# EAGLE design motor board (EAGLE 6.5.0)
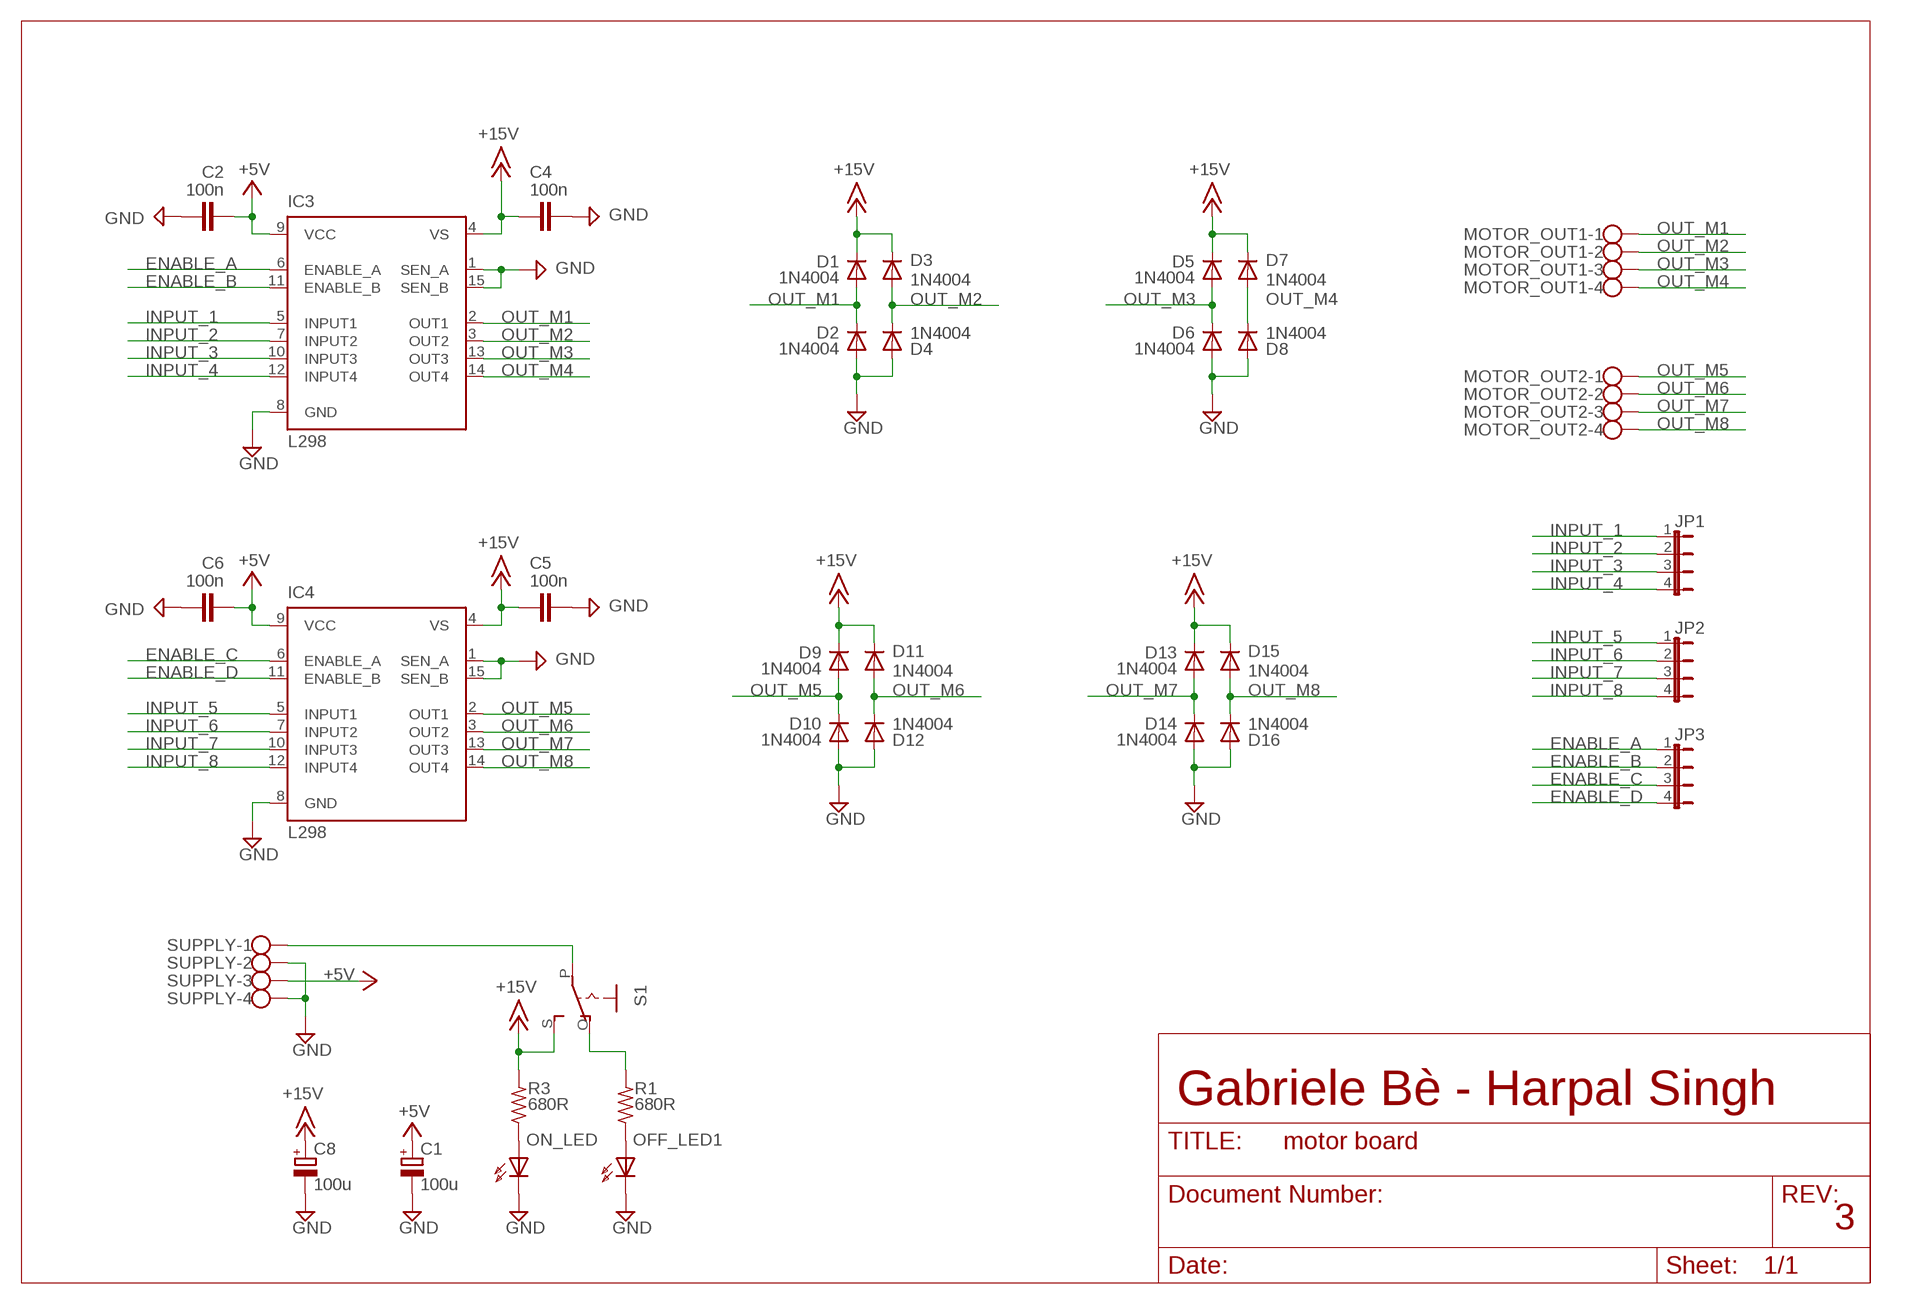
[diagram p0: schematic, sheet 1]

## Parts
C1  100u  CPOL-EUE2.5-7  [E2,5-7]
C2  100n  C-EU050-024X044  [C050-024X044]
C4  100n  C-EU050-024X044  [C050-024X044]
C5  100n  C-EU050-024X044  [C050-024X044]
C6  100n  C-EU050-024X044  [C050-024X044]
C8  100u  CPOL-EUE2.5-7  [E2,5-7]
D1  1N4004  [DO41-10]
D2  1N4004  [DO41-10]
D3  1N4004  [DO41-10]
D4  1N4004  [DO41-10]
D5  1N4004  [DO41-10]
D6  1N4004  [DO41-10]
D7  1N4004  [DO41-10]
D8  1N4004  [DO41-10]
D9  1N4004  [DO41-10]
D10  1N4004  [DO41-10]
D11  1N4004  [DO41-10]
D12  1N4004  [DO41-10]
D13  1N4004  [DO41-10]
D14  1N4004  [DO41-10]
D15  1N4004  [DO41-10]
D16  1N4004  [DO41-10]
IC3  L298  [MULTIWATT-15]
IC4  L298  [MULTIWATT-15]
JP1  JP4E  [JP4]
JP2  JP4E  [JP4]
JP3  JP4E  [JP4]
MOTOR_OUT1  W237-4  [W237-4]
MOTOR_OUT2  W237-4  [W237-4]
OFF_LED1  HLMP6  [HLMP6]
ON_LED  HLMP6  [HLMP6]
R1  680R  R-US_0207/10  [0207/10]
R3  680R  R-US_0207/10  [0207/10]
S1  EG1218S  [EG1218]
SUPPLY  W237-4  [W237-4]

## Nets
+5V: C1.+ C2.2 C6.2 IC3.9(VCC) IC4.9(VCC) SUPPLY.3
+15V: C4.1 C5.1 C8.+ D1.C D3.C D5.C D7.C D9.C D11.C D13.C D15.C IC3.4(VS) IC4.4(VS) R3.2 S1.S
ENABLE_A: IC3.6(ENABLE_A) JP3.1
ENABLE_B: IC3.11(ENABLE_B) JP3.2
ENABLE_C: IC4.6(ENABLE_A) JP3.3
ENABLE_D: IC4.11(ENABLE_B) JP3.4
GND: C1.- C2.1 C4.2 C5.2 C6.1 C8.- D2.A D4.A D6.A D8.A D10.A D12.A D14.A D16.A IC3.1(SEN_A) IC3.8(GND) IC3.15(SEN_B) IC4.1(SEN_A) IC4.8(GND) IC4.15(SEN_B) OFF_LED1.K ON_LED.K SUPPLY.2 SUPPLY.4
INPUT_1: IC3.5(INPUT1) JP1.1
INPUT_2: IC3.7(INPUT2) JP1.2
INPUT_3: IC3.10(INPUT3) JP1.3
INPUT_4: IC3.12(INPUT4) JP1.4
INPUT_5: IC4.5(INPUT1) JP2.1
INPUT_6: IC4.7(INPUT2) JP2.2
INPUT_7: IC4.10(INPUT3) JP2.3
INPUT_8: IC4.12(INPUT4) JP2.4
N$1: OFF_LED1.A R1.1
N$3: ON_LED.A R3.1
N$4: S1.P SUPPLY.1
N$5: R1.2 S1.O
OUT_M1: D1.A D2.C IC3.2(OUT1) MOTOR_OUT1.1
OUT_M2: D3.A D4.C IC3.3(OUT2) MOTOR_OUT1.2
OUT_M3: D5.A D6.C IC3.13(OUT3) MOTOR_OUT1.3
OUT_M4: D7.A D8.C IC3.14(OUT4) MOTOR_OUT1.4
OUT_M5: D9.A D10.C IC4.2(OUT1) MOTOR_OUT2.1
OUT_M6: D11.A D12.C IC4.3(OUT2) MOTOR_OUT2.2
OUT_M7: D13.A D14.C IC4.13(OUT3) MOTOR_OUT2.3
OUT_M8: D15.A D16.C IC4.14(OUT4) MOTOR_OUT2.4

## Notes on the sheet
- Gabriele Bè - Harpal Singh
- 3

## Library data of the parts
C1 C8 = ITIS:CPOL-EU: POLARIZED CAPACITOR, European symbol
C2 C4-C6 = rcl:C-EU: CAPACITOR, European symbol
D1-D16 = ITIS:1N4004: DIODE general purpose rectifier, 1 A
IC3 IC4 = st-microelectronics:L298: DUAL FULL-BRIDGE DRIVER
JP1-JP3 = ITIS_v2:JP4E: JUMPER
MOTOR_OUT1 MOTOR_OUT2 SUPPLY = con-wago-500:W237-4: WAGO SCREW CLAMP; OC_FARNELL: unknown; OC_NEWARK: unknown
OFF_LED1 ON_LED = display-hp:HLMP6: LED 2mm horizontal; MF: AGILENT TECHNOLOGIES; MPN: HLMP-6500; OC_FARNELL: 1652490; OC_NEWARK: 40K0088
R1 R3 = resistor:R-US_: RESISTOR, American symbol
S1 = adafruit:EG1218: SLIDING SWITCH 0.1" spacing through hole, vertical SPDT slide switch http://www.ladyada.net/library/pcb/eaglelibrary.html

## Board
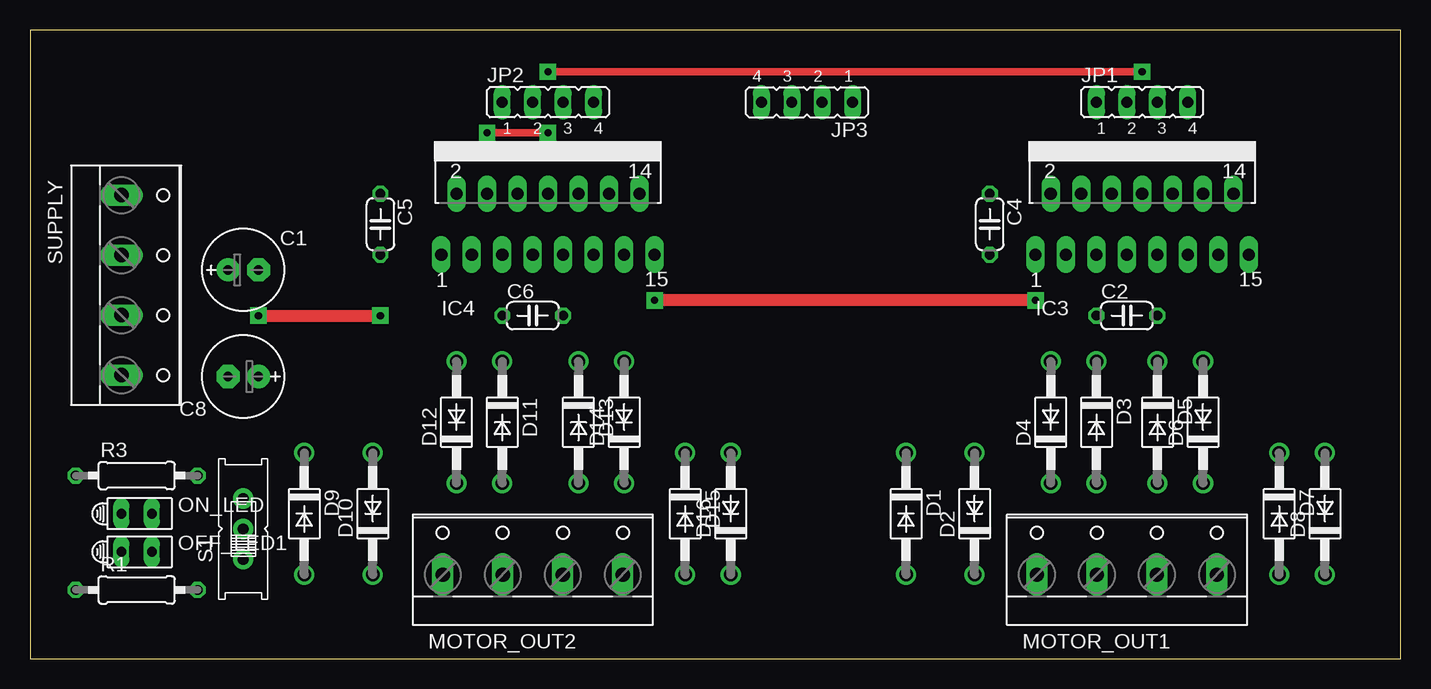
[diagram p1: board, top side]
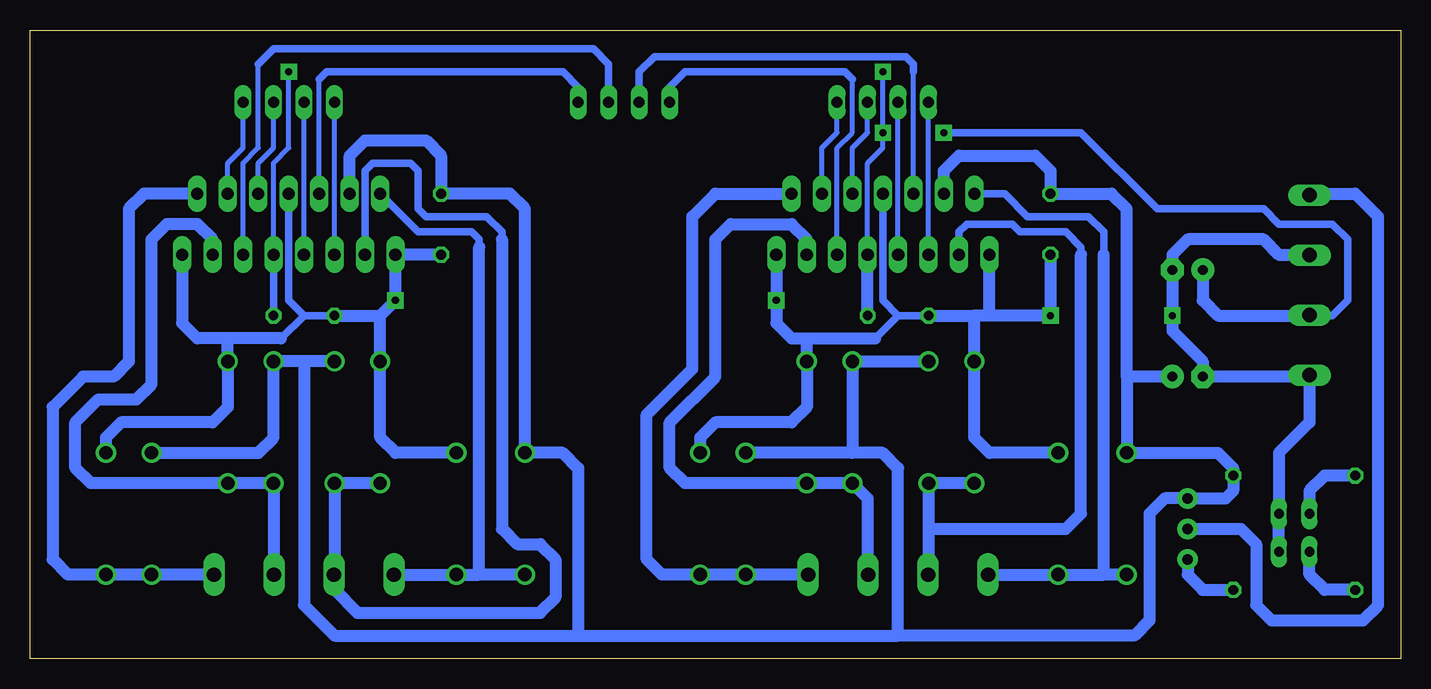
[diagram p2: board, bottom side, seen from below]

Size 114.28 x 52.38 mm. Coordinates in mm from the lower left corner, seen from the top.
Outline: 0,0 114.28,0 114.28,52.38 0,52.38 0,0
Copper layers (1*16): Top 0.035mm / dielectric 1.5mm / Bottom 0.035mm
Design rules "default *": minimum track width 10mil, minimum drill 40mil, track to track 8mil, track to pad 8mil, pad to pad 8mil, via to via 8mil, smd to smd 8mil, copper to edge 40mil, drill to drill 8mil, minimum pad ring 10mil, minimum via ring 15mil, stop-mask expansion 4mil, vias tented up to drill 0mil, thermal gap 10mil

### Footprints (pad centres in the part's own frame; a part is rotated, then mirrored left to right if it is on the bottom)
E2,5-7 = drill 0.813 pad 1.93: + -1.27,0 | drill 0.813 pad 1.93 octagon: - 1.27,0
C050-024X044 = drill 0.813 octagon: 1 -2.54,0; 2 2.54,0
DO41-10 = drill 1.118: A 5.08,0; C -5.08,0
MULTIWATT-15 = drill 1.016 long: 1 -8.89,-7.62; 2 -7.62,-2.54; 3 -6.35,-7.62; 4 -5.08,-2.54; 5 -3.81,-7.62; 6 -2.54,-2.54; 7 -1.27,-7.62; 8 0,-2.54; 9 1.27,-7.62; 10 2.54,-2.54; 11 3.81,-7.62; 12 5.08,-2.54; 13 6.35,-7.62; 14 7.62,-2.54; 15 8.89,-7.62
JP4 = drill 0.914 long: 1 -3.81,0; 2 -1.27,0; 3 1.27,0; 4 3.81,0
W237-4 = drill 1.194 long: 1 -7.5,-1.27; 2 -2.5,-1.27; 3 2.5,-1.27; 4 7.5,-1.27
HLMP6 = drill 0.813 long: A -1.27,0; K 1.27,0
0207/10 = drill 0.813 octagon: 1 -5.08,0; 2 5.08,0
EG1218 = drill 0.9 pad 1.676: O -2.54,0; P 0,0; S 2.54,0

### Placement (x,y rotation side)
C1  17.78,32.38 0 top
C2  91.44,28.58 0 top
C4  80.01,36.2 270 top
C5  29.21,36.2 270 top
C6  41.91,28.58 0 top
C8  17.78,23.5 180 top
D1  73.03,12.07 270 top
D2  78.74,12.07 90 top
D3  88.9,19.69 270 top
D4  85.09,19.69 90 top
D5  93.98,19.69 270 top
D6  97.79,19.69 90 top
D7  104.14,12.07 270 top
D8  107.95,12.07 90 top
D9  22.86,12.07 270 top
D10  28.57,12.07 90 top
D11  39.37,19.69 270 top
D12  35.56,19.69 90 top
D13  45.72,19.69 270 top
D14  49.53,19.69 90 top
D15  54.61,12.07 270 top
D16  58.42,12.07 90 top
IC3  92.71,41.27 0 top
IC4  43.18,41.27 0 top
JP1  92.71,46.35 0 top
JP2  43.18,46.35 0 top
JP3  64.77,46.35 180 top
MOTOR_OUT1  91.44,8.26 0 top
MOTOR_OUT2  41.91,8.26 0 top
OFF_LED1  8.89,8.89 0 top
ON_LED  8.89,12.07 0 top
R1  8.89,5.72 0 top
R3  8.89,15.24 0 top
S1  17.78,10.8 90 top
SUPPLY  8.89,31.12 270 top

### Tracks (layer width: path | path; a pad name or v marks a point on that pad's centre or on a via)
+5V  (via drill 0.6)
  Top 0.61: v43.18,48.9 v92.71,48.9 | v43.18,43.82 v38.1,43.82
  Bottom 0.406: IC3.9 93.98,41.27 92.71,42.55 v92.71,48.9 | IC4.9 44.45,41.27 43.18,42.55 v43.18,43.82 v43.18,48.9
  Bottom 0.61: C2.2 IC3.9 | 7.66,28.58 5.71,28.58 4.45,29.84 4.45,34.93 5.71,36.2 10.16,36.2 11.43,37.46 20.32,37.46 26.67,43.82 v38.1,43.82
  Bottom 1.016: C6.2 IC4.9 | SUPPLY.3 7.66,28.58 15.24,28.58 16.51,29.84 C1.+
+15V
  Bottom 1.016: 91.44,24.77 D5.C 93.98,18.41 95.25,17.15 D7.C | D3.C 91.44,24.77 | 91.44,24.77 91.44,4.45 88.9,1.91 68.58,1.91 | IC3.4 87.63,41.91 86.36,43.18 81.28,43.18 80.01,41.91 C4.1 74.3,38.74 73.03,37.46 D1.C 69.85,17.15 68.58,15.88 68.58,1.91 | D11.C D13.C 45.72,17.15 | 45.72,17.15 43.18,17.15 41.91,15.88 41.91,1.91 | 45.72,17.15 D15.C | 22.23,17.15 D9.C | 22.86,23.5 22.86,37.46 24.13,38.74 C5.1 29.21,40.64 30.48,41.91 36.83,41.91 38.1,40.64 IC4.4 | 68.58,1.91 41.91,1.91 | C8.+ 22.86,23.5 | 22.86,23.5 D9.C | D9.C 15.24,17.15 13.97,15.88 R3.2 13.97,13.97 14.6,13.34 S1.S 19.69,13.34 20.95,12.07 20.95,3.18 22.23,1.91 41.91,1.91
ENABLE_A
  Bottom 0.406: IC3.6 90.17,48.26
  Bottom 0.61: JP3.1 68.58,47.63 69.85,48.9 89.53,48.9 90.17,48.26
ENABLE_B
  Bottom 0.406: IC3.11 96.52,41.27 95.25,42.55 95.25,49.53
  Bottom 0.61: JP3.2 66.04,49.53 67.31,50.8 93.98,50.8 95.25,49.53
ENABLE_C
  Bottom 0.406: IC4.6 40.64,48.9
  Bottom 0.61: 40.64,48.9 40.64,49.53 41.27,50.16 62.23,50.16 63.5,48.9 JP3.3
ENABLE_D
  Bottom 0.406: IC4.11 46.99,42.55 45.72,43.82 45.72,48.26
  Bottom 0.61: JP3.4 60.96,47.63 59.69,48.9 46.36,48.9 45.72,48.26
GND  (via drill 0.6)
  Top 1.016: v19.05,28.58 v29.21,28.58 | v83.82,29.84 v52.07,29.84
  Bottom 0.61: IC3.8 92.71,29.84 91.44,28.58 | C2.1 91.44,28.58 | 93.34,26.67 91.44,28.58 | IC4.8 43.18,29.84 41.91,28.58 | C6.1 41.91,28.58 | 43.81,26.67 41.91,28.58
  Bottom 1.016: D8.A 107.95,18.41 106.68,19.69 99.06,19.69 97.79,20.96 D6.A 97.79,26.67 | C4.2 IC3.1 v83.82,29.84 85.09,28.58 | C2.1 85.09,28.58 | 93.34,26.67 97.79,26.67 | 97.79,26.67 100.33,26.67 101.6,27.94 IC3.15 | C6.1 35.56,28.58 | 34.29,28.58 IC4.1 | 35.56,28.58 D12.A 35.56,18.41 34.29,17.15 D10.A | D16.A 58.42,18.41 57.15,19.69 50.8,19.69 49.53,20.96 D14.A 49.53,26.67 | IC4.15 v52.07,29.84 52.07,27.94 50.8,26.67 49.53,26.67 | 49.53,26.67 43.81,26.67 | 7.62,23.5 7.62,19.69 10.16,17.15 ON_LED.K OFF_LED1.K | SUPPLY.4 7.62,23.5 | 7.62,23.5 C8.- 16.51,24.77 19.05,27.3 v19.05,28.58 C1.- 19.05,33.66 17.78,34.93 11.43,34.93 10.12,33.62 SUPPLY.2 | C5.2 v29.21,28.58 34.29,28.58 | 34.29,28.58 35.56,28.58 | D2.A 83.82,17.15 85.09,18.41 D4.A 85.09,28.58
INPUT_1
  Bottom 0.406: IC3.5 JP1.1
INPUT_2
  Bottom 0.406: IC3.7 JP1.2
INPUT_3
  Bottom 0.406: IC3.10 95.25,41.27 93.98,42.55 JP1.3
INPUT_4
  Bottom 0.406: IC3.12 97.79,41.27 96.52,42.55 JP1.4
INPUT_5
  Bottom 0.406: IC4.5 JP2.1
INPUT_6
  Bottom 0.406: IC4.7 JP2.2
INPUT_7
  Bottom 0.406: IC4.10 45.72,42.55 44.45,43.82 JP2.3
INPUT_8
  Bottom 0.406: IC4.12 48.26,42.55 46.99,43.82 JP2.4
N$1
  Bottom 1.016: R1.1 6.35,5.72 7.62,6.98 OFF_LED1.A
N$3
  Bottom 1.016: R3.1 6.35,15.24 7.62,13.97 ON_LED.A
N$4
  Bottom 1.016: SUPPLY.1 7.5,38.74 3.81,38.74 1.9,36.83 1.9,4.45 3.17,3.18 10.79,3.18 12.06,4.45 12.06,9.52 13.33,10.8 S1.P
N$5
  Bottom 1.016: S1.O 17.78,6.98 16.51,5.72 R1.2
OUT_M1
  Bottom 0.61: 76.83,34.29 76.83,34.93 77.47,35.56 81.91,35.56 IC3.2
  Bottom 1.016: MOTOR_OUT1.1 D2.C 76.83,6.98 | D1.A 76.83,6.98 | 76.83,6.98 76.83,34.29
OUT_M2
  Bottom 0.61: 74.93,34.93 74.93,35.56 76.2,36.83 81.28,36.83 81.91,37.46 81.91,40.64 82.55,41.27 85.72,41.27 86.36,40.64 IC3.3
  Bottom 1.016: D3.A 88.9,7.02 MOTOR_OUT1.2 | D4.C D3.A | D3.A 88.9,5.72 87,3.81 71.75,3.81 70.48,5.08 70.48,8.26 71.75,9.52 73.66,9.52 74.93,10.8 74.93,34.93
OUT_M3
  Bottom 1.016: MOTOR_OUT1.3 93.98,7.02 D5.A D6.C 109.22,14.61 110.49,15.88 110.49,19.69 108.58,21.59 105.41,21.59 104.14,22.86 104.14,34.93 102.87,36.2 100.33,36.2 99.06,34.93 IC3.13
OUT_M4
  Bottom 1.016: D8.C D7.A MOTOR_OUT1.4 111.12,6.98 112.4,8.26 112.4,20.96 109.86,23.5 107.31,23.5 106.05,24.77 106.05,37.46 104.78,38.74 IC3.14
OUT_M5
  Bottom 0.61: 24.77,33.66 24.77,35.56 26.03,36.83 31.12,36.83 33.02,38.74 IC4.2
  Bottom 1.016: D9.A 24.77,6.98 | MOTOR_OUT2.1 D10.C 24.77,6.98 | 24.77,6.98 24.77,33.66
OUT_M6
  Bottom 0.61: 26.67,33.66 26.67,34.29 27.94,35.56 31.75,35.56 32.38,36.2 36.2,36.2 36.83,35.56 IC4.3
  Bottom 1.016: 39.37,10.8 39.37,7.02 MOTOR_OUT2.2 | D12.C D11.A 39.37,10.8 | 39.37,10.8 27.94,10.8 26.67,12.07 26.67,33.66
OUT_M7
  Bottom 1.016: MOTOR_OUT2.3 44.45,7.02 44.45,13.34 D13.A D14.C 59.69,14.61 60.96,15.88 60.96,19.69 57.15,23.5 57.15,34.93 55.88,36.2 50.8,36.2 49.53,34.93 IC4.13
OUT_M8
  Bottom 1.016: D16.C D15.A MOTOR_OUT2.4 61.59,6.98 62.86,8.26 62.86,20.32 59.05,24.13 59.05,36.83 57.15,38.74 IC4.14